# Altium schematic sheet HOME_LAMPS_AUTOMATIC.SchDoc
size A4; SheetNumber: 1; SheetTotal: 1
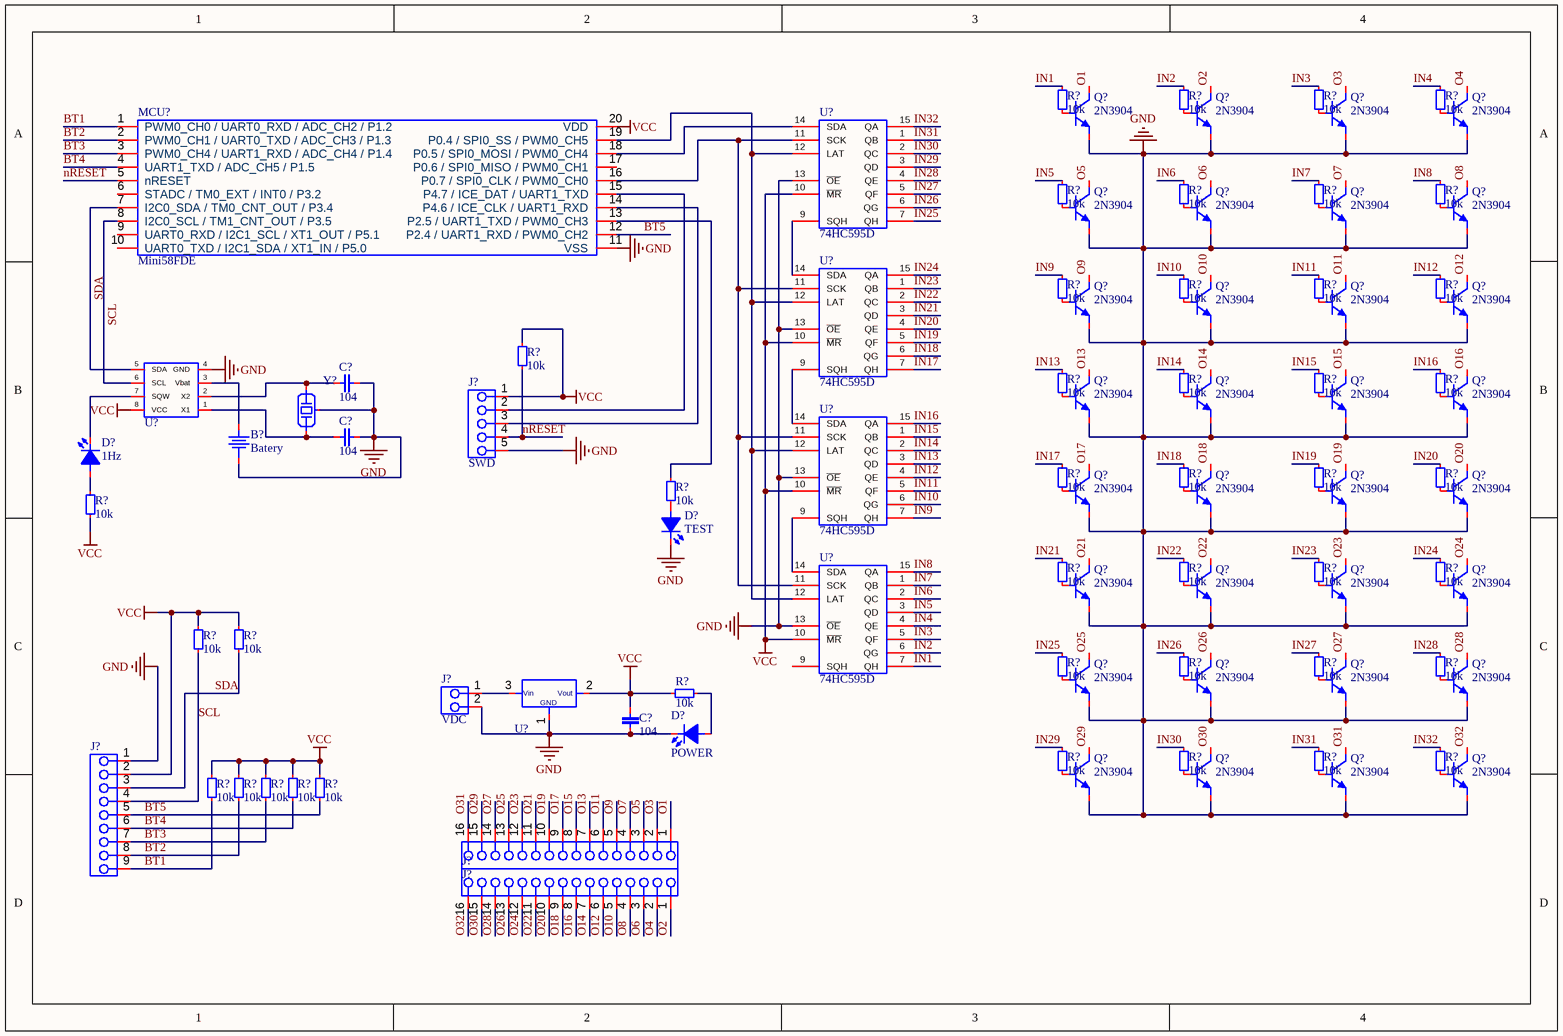
[diagram p0: HOME_LAMPS_AUTOMATIC.SchDoc]

## Parts
(Parts that share a designator on the sheet are numbered #1, #2 ... from top to bottom, then left to right.)
B?  Batery  [CR1220]
C?#1  104  [C0805]
C?#2  104  [C0805]
C?#3  104  [C0805]
D?#1  1Hz  [L0805RED]
D?#2  TEST  [L0805RED]
D?#3  POWER  [L0805RED]
J?#1  SWD  [HEADER-FEMALE-05PINS-2.54MM]
J?#2  VDC  [JST - XH - Thru (R) - 2Pin - 2.54mm]
J?#3  HEADER-MALE-2.54MM  [HEADER-MALE-09PINS-2.54MM]  (value not drawn)
J?#4  HEADER-MALE-2.54MM  [HEADER-MALE-16PINS-2.54MM]  (value not drawn)
J?#5  HEADER-MALE-2.54MM  [HEADER-MALE-16PINS-2.54MM]  (value not drawn)
MCU?  Mini58FDE  [TSSOP20_0.65_4.4]
Q?#1  2N3904  [SOT23-3]
Q?#2  2N3904  [SOT23-3]
Q?#3  2N3904  [SOT23-3]
Q?#4  2N3904  [SOT23-3]
Q?#5  2N3904  [SOT23-3]
Q?#6  2N3904  [SOT23-3]
Q?#7  2N3904  [SOT23-3]
Q?#8  2N3904  [SOT23-3]
Q?#9  2N3904  [SOT23-3]
Q?#10  2N3904  [SOT23-3]
Q?#11  2N3904  [SOT23-3]
Q?#12  2N3904  [SOT23-3]
Q?#13  2N3904  [SOT23-3]
Q?#14  2N3904  [SOT23-3]
Q?#15  2N3904  [SOT23-3]
Q?#16  2N3904  [SOT23-3]
Q?#17  2N3904  [SOT23-3]
Q?#18  2N3904  [SOT23-3]
Q?#19  2N3904  [SOT23-3]
Q?#20  2N3904  [SOT23-3]
Q?#21  2N3904  [SOT23-3]
Q?#22  2N3904  [SOT23-3]
Q?#23  2N3904  [SOT23-3]
Q?#24  2N3904  [SOT23-3]
Q?#25  2N3904  [SOT23-3]
Q?#26  2N3904  [SOT23-3]
Q?#27  2N3904  [SOT23-3]
Q?#28  2N3904  [SOT23-3]
Q?#29  2N3904  [SOT23-3]
Q?#30  2N3904  [SOT23-3]
Q?#31  2N3904  [SOT23-3]
Q?#32  2N3904  [SOT23-3]
R?#1  10k  [R0805]
R?#2  10k  [R0805]
R?#3  10k  [R0805]
R?#4  10k  [R0805]
R?#5  10k  [R0805]
R?#6  10k  [R0805]
R?#7  10k  [R0805]
R?#8  10k  [R0805]
R?#9  10k  [R0805]
R?#10  10k  [R0805]
R?#11  10k  [R0805]
R?#12  10k  [R0805]
R?#13  10k  [R0805]
R?#14  10k  [R0805]
R?#15  10k  [R0805]
R?#16  10k  [R0805]
R?#17  10k  [R0805]
R?#18  10k  [R0805]
R?#19  10k  [R0805]
R?#20  10k  [R0805]
R?#21  10k  [R0805]
R?#22  10k  [R0805]
R?#23  10k  [R0805]
R?#24  10k  [R0805]
R?#25  10k  [R0805]
R?#26  10k  [R0805]
R?#27  10k  [R0805]
R?#28  10k  [R0805]
R?#29  10k  [R0805]
R?#30  10k  [R0805]
R?#31  10k  [R0805]
R?#32  10k  [R0805]
R?#33  10k  [R0805]
R?#34  10k  [R0805]
R?#35  10k  [R0805]
R?#36  10k  [R0805]
R?#37  10k  [R0805]
R?#38  10k  [R0805]
R?#39  10k  [R0805]
R?#40  10k  [R0805]
R?#41  10k  [R0805]
R?#42  10k  [R0805]
R?#43  10k  [R0805]
U?#1  74HC595D  [SO16]
U?#2  74HC595D  [SO16]
U?#3  74HC595D  [SO16]
U?#4  RealTime  [SOIC08_1.27_6.0]  (value not drawn)
U?#5  74HC595D  [SO16]
U?#6  AMS1117  [SOT223-3]  (value not drawn)
Y?  32.768KHz  [DT-26]  (value not drawn)

## Nets
GND: B?.2 C?#1.2 C?#2.2 C?#3.1 D?#2.2(K) D?#3.2(K) J?#1.5 J?#2.2 J?#3.1 MCU?.11(VSS) Q?#1.2(E) Q?#2.2(E) Q?#3.2(E) Q?#4.2(E) Q?#5.2(E) Q?#6.2(E) Q?#7.2(E) Q?#8.2(E) Q?#9.2(E) Q?#10.2(E) Q?#11.2(E) Q?#12.2(E) Q?#13.2(E) Q?#14.2(E) Q?#15.2(E) Q?#16.2(E) Q?#17.2(E) Q?#18.2(E) Q?#19.2(E) Q?#20.2(E) Q?#21.2(E) Q?#22.2(E) Q?#23.2(E) Q?#24.2(E) Q?#25.2(E) Q?#26.2(E) Q?#27.2(E) Q?#28.2(E) Q?#29.2(E) Q?#30.2(E) Q?#31.2(E) Q?#32.2(E) U?#1.8 U?#1.13(~{OE}) U?#2.8 U?#2.13(~{OE}) U?#3.8 U?#3.13(~{OE}) U?#4.4(GND) U?#5.8 U?#5.13(~{OE}) U?#6.1 Y?.3(GND)
VCC: C?#3.2 J?#1.1 J?#3.2 MCU?.20(VDD) R?#13.2 R?#23.1 R?#28.2 R?#29.2 R?#34.1 R?#39.2 R?#40.2 R?#41.2 R?#42.2 R?#43.2 U?#1.10(~{MR}) U?#1.16 U?#2.10(~{MR}) U?#2.16 U?#3.10(~{MR}) U?#3.16 U?#4.8(VCC) U?#5.10(~{MR}) U?#5.16 U?#6.2
BT1: J?#3.9 MCU?.1(PWM0_CH0_/_UART0_RXD_/_ADC_CH2_/_P1.2) R?#39.1
BT2: J?#3.8 MCU?.2(PWM0_CH1_/_UART0_TXD_/_ADC_CH3_/_P1.3) R?#40.1
BT3: J?#3.7 MCU?.3(PWM0_CH4_/_UART1_RXD_/_ADC_CH4_/_P1.4) R?#41.1
BT4: J?#3.6 MCU?.4(UART1_TXD_/_ADC_CH5_/_P1.5) R?#42.1
BT5: J?#3.5 MCU?.12(P2.4_/_UART1_RXD_/_PWM0_CH2) R?#43.1
IN1: R?#1.1 U?#5.7(QH)
IN2: R?#2.2 U?#5.6(QG)
IN3: R?#3.2 U?#5.5(QF)
IN4: R?#4.2 U?#5.4(QE)
IN5: R?#5.1 U?#5.3(QD)
IN6: R?#6.2 U?#5.2(QC)
IN7: R?#7.2 U?#5.1(QB)
IN8: R?#8.2 U?#5.15(QA)
IN9: R?#9.1 U?#3.7(QH)
IN10: R?#10.2 U?#3.6(QG)
IN11: R?#11.2 U?#3.5(QF)
IN12: R?#12.2 U?#3.4(QE)
IN13: R?#14.2 U?#3.3(QD)
IN14: R?#15.2 U?#3.2(QC)
IN15: R?#16.2 U?#3.1(QB)
IN16: R?#17.2 U?#3.15(QA)
IN17: R?#18.2 U?#2.7(QH)
IN18: R?#19.2 U?#2.6(QG)
IN19: R?#20.2 U?#2.5(QF)
IN20: R?#21.2 U?#2.4(QE)
IN21: R?#24.2 U?#2.3(QD)
IN22: R?#25.2 U?#2.2(QC)
IN23: R?#26.2 U?#2.1(QB)
IN24: R?#27.2 U?#2.15(QA)
IN25: R?#30.2 U?#1.7(QH)
IN26: R?#31.2 U?#1.6(QG)
IN27: R?#32.2 U?#1.5(QF)
IN28: R?#33.2 U?#1.4(QE)
IN29: R?#35.2 U?#1.3(QD)
IN30: R?#36.2 U?#1.2(QC)
IN31: R?#37.2 U?#1.1(QB)
IN32: R?#38.2 U?#1.15(QA)
nRESET: J?#1.4 MCU?.5(nRESET) R?#13.1
O1: J?#5.1 Q?#1.3(C)
O2: J?#4.1 Q?#2.3(C)
O3: J?#5.2 Q?#3.3(C)
O4: J?#4.2 Q?#4.3(C)
O5: J?#5.3 Q?#5.3(C)
O6: J?#4.3 Q?#6.3(C)
O7: J?#5.4 Q?#7.3(C)
O8: J?#4.4 Q?#8.3(C)
O9: J?#5.5 Q?#9.3(C)
O10: J?#4.5 Q?#10.3(C)
O11: J?#5.6 Q?#11.3(C)
O12: J?#4.6 Q?#12.3(C)
O13: J?#5.7 Q?#13.3(C)
O14: J?#4.7 Q?#14.3(C)
O15: J?#5.8 Q?#15.3(C)
O16: J?#4.8 Q?#16.3(C)
O17: J?#5.9 Q?#17.3(C)
O18: J?#4.9 Q?#18.3(C)
O19: J?#5.10 Q?#19.3(C)
O20: J?#4.10 Q?#20.3(C)
O21: J?#5.11 Q?#21.3(C)
O22: J?#4.11 Q?#22.3(C)
O23: J?#5.12 Q?#23.3(C)
O24: J?#4.12 Q?#24.3(C)
O25: J?#5.13 Q?#25.3(C)
O26: J?#4.13 Q?#26.3(C)
O27: J?#5.14 Q?#27.3(C)
O28: J?#4.14 Q?#28.3(C)
O29: J?#5.15 Q?#29.3(C)
O30: J?#4.15 Q?#30.3(C)
O31: J?#5.16 Q?#31.3(C)
O32: J?#4.16 Q?#32.3(C)
SCL: J?#3.4 MCU?.8(I2C0_SCL_/_TM1_CNT_OUT_/_P3.5) R?#28.1 U?#4.6(SCL)
SDA: J?#3.3 MCU?.7(I2C0_SDA_/_TM0_CNT_OUT_/_P3.4) R?#29.1 U?#4.5(SDA)
NetB?_1: B?.1 U?#4.3(Vbat)
NetC?#1_1: C?#1.1 U?#4.2(X2) Y?.2
NetC?#2_1: C?#2.1 U?#4.1(X1) Y?.1
NetD?#1_1: D?#1.1(A) R?#23.2
NetD?#1_2: D?#1.2(K) U?#4.7(SQW)
NetD?#2_1: D?#2.1(A) R?#22.2
NetD?#3_1: D?#3.1(A) R?#34.2
NetJ?#1_2: J?#1.2 MCU?.15(P4.7_/_ICE_DAT_/_UART1_TXD)
NetJ?#1_3: J?#1.3 MCU?.14(P4.6_/_ICE_CLK_/_UART1_RXD)
NetJ?#2_1: J?#2.1 U?#6.3
NetMCU?_13: MCU?.13(P2.5_/_UART1_TXD_/_PWM0_CH3) R?#22.1
NetMCU?_16: MCU?.16(P0.7_/_SPI0_CLK_/_PWM0_CH0) U?#1.11(SCK) U?#2.11(SCK) U?#3.11(SCK) U?#5.11(SCK)
NetMCU?_18: MCU?.18(P0.5_/_SPI0_MOSI_/_PWM0_CH4) U?#1.14(SDA)
NetMCU?_19: MCU?.19(P0.4_/_SPI0_SS_/_PWM0_CH5) U?#1.12(LAT) U?#2.12(LAT) U?#3.12(LAT) U?#5.12(LAT)
NetQ?#1_1: Q?#1.1(B) R?#1.2
NetQ?#2_1: Q?#2.1(B) R?#2.1
NetQ?#3_1: Q?#3.1(B) R?#3.1
NetQ?#4_1: Q?#4.1(B) R?#4.1
NetQ?#5_1: Q?#5.1(B) R?#5.2
NetQ?#6_1: Q?#6.1(B) R?#6.1
NetQ?#7_1: Q?#7.1(B) R?#7.1
NetQ?#8_1: Q?#8.1(B) R?#8.1
NetQ?#9_1: Q?#9.1(B) R?#9.2
NetQ?#10_1: Q?#10.1(B) R?#10.1
NetQ?#11_1: Q?#11.1(B) R?#11.1
NetQ?#12_1: Q?#12.1(B) R?#12.1
NetQ?#13_1: Q?#13.1(B) R?#14.1
NetQ?#14_1: Q?#14.1(B) R?#15.1
NetQ?#15_1: Q?#15.1(B) R?#16.1
NetQ?#16_1: Q?#16.1(B) R?#17.1
NetQ?#17_1: Q?#17.1(B) R?#18.1
NetQ?#18_1: Q?#18.1(B) R?#19.1
NetQ?#19_1: Q?#19.1(B) R?#20.1
NetQ?#20_1: Q?#20.1(B) R?#21.1
NetQ?#21_1: Q?#21.1(B) R?#24.1
NetQ?#22_1: Q?#22.1(B) R?#25.1
NetQ?#23_1: Q?#23.1(B) R?#26.1
NetQ?#24_1: Q?#24.1(B) R?#27.1
NetQ?#25_1: Q?#25.1(B) R?#30.1
NetQ?#26_1: Q?#26.1(B) R?#31.1
NetQ?#27_1: Q?#27.1(B) R?#32.1
NetQ?#28_1: Q?#28.1(B) R?#33.1
NetQ?#29_1: Q?#29.1(B) R?#35.1
NetQ?#30_1: Q?#30.1(B) R?#36.1
NetQ?#31_1: Q?#31.1(B) R?#37.1
NetQ?#32_1: Q?#32.1(B) R?#38.1
NetU?#1_9: U?#1.9(SQH) U?#2.14(SDA)
NetU?#2_9: U?#2.9(SQH) U?#3.14(SDA)
NetU?#3_9: U?#3.9(SQH) U?#5.14(SDA)

Not connected (* = marked no-connect by the designer): MCU? 6(STADC_/_TM0_EXT_/_INT0_/_P3.2) 9(UART0_RXD_/_I2C1_SCL_/_XT1_OUT_/_P5.1) 10(UART0_TXD_/_I2C1_SDA_/_XT1_IN_/_P5.0) 17(P0.6_/_SPI0_MISO_/_PWM0_CH1); U?#5 9(SQH)

## Notes on the sheet
- (in symbol Ic-AMS1117(SOT-223)) Vin; Vout; GND

## Library data of the parts
C?#1-C?#3 = Capacitors(SMD)
D?#1-D?#3 = LED0805
J?#1 = HEADER-FEMALE-05PINS-2.54MM
J?#2 = JST - XH - Thru (R) - 2Pin - 2.54mm
J?#3 = HEADER-MALE-09PINS-2.54MM
J?#4 J?#5 = HEADER-MALE-16PINS-2.54MM
MCU? = Mcu-Mini58FDE: Novoton 4Kb-RAM 32Kb-Flash
Q?#1-Q?#32 = Transistor-2N3904 (SOT-23)
R?#1-R?#43 = Resistors-SMD
U?#1-U?#3 U?#5 = Ic-74HC595D
U?#4 = RealTime-DS1307
U?#6 = Ic-AMS1117(SOT-223)
Y? = Crystal 32.768KHz